# EAGLE schematic sound level meter 9000 (EAGLE 9.6.2)
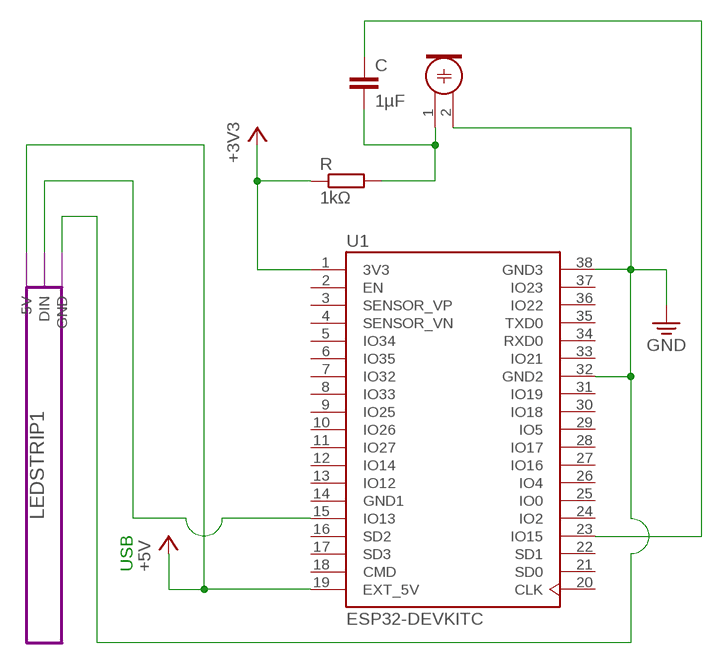
[diagram p0: schematic, sheet 1]

## Parts
C  1µF  C-EU025-024X044  [C025-024X044]
ELECTRETMICROPHONE  ELECTRET_MICROPHON-F6035AP  [F6035AP]
R  1kΩ  R-EU_0204/2V  [0204V]
U1  ESP32-DEVKITC  [MODULE_ESP32-DEVKITC]

## Module instances
LEDSTRIP1 = LEDSTRIP

## Nets
+3V3: R.1 U1.1(3V3)
+5V: U1.19(EXT_5V) ; port LEDSTRIP1.5V
GND: ELECTRETMICROPHONE.2 U1.32(GND2) U1.38(GND3) ; port LEDSTRIP1.GND
N$2: C.2 ELECTRETMICROPHONE.1 R.2
N$4: C.1 U1.23(IO15)
N$7: U1.15(IO13) ; port LEDSTRIP1.DIN
Unconnected: U1.2(EN) U1.3(SENSOR_VP) U1.4(SENSOR_VN) U1.5(IO34) U1.6(IO35) U1.7(IO32) U1.8(IO33) U1.9(IO25) U1.10(IO26) U1.11(IO27) U1.12(IO14) U1.13(IO12) U1.16(SD2) U1.17(SD3) U1.18(CMD) U1.20(CLK) U1.21(SD0) U1.22(SD1) U1.24(IO2) U1.25(IO0) U1.26(IO4) U1.27(IO16) U1.28(IO17) U1.29(IO5) U1.30(IO18) U1.31(IO19) U1.33(IO21) U1.34(RXD0) U1.35(TXD0) U1.36(IO22) U1.37(IO23)

## Notes on the sheet
- USB

## Power pins joined to a net without a drawn wire
GND1: U1.14(GND1)

## Library data of the parts
C = rcl:C-EU: CAPACITOR, European symbol; SPICEPREFIX: C
ELECTRETMICROPHONE = microphon:ELECTRET_MICROPHON-: Electret Condenser Microphone
R = rcl:R-EU_: RESISTOR, European symbol; SPICEPREFIX: R
U1 = ESP32-DEVKITC:ESP32-DEVKITC: ESP32-DEVKITC; MANUFACTURER: ESPRESSIF; PARTREV: N/A; STANDARD: Manufacturer Recommendations

## Module LEDSTRIP
Ports: GND(pas) DIN(pas) 5V(pas)

### Library data of the parts